# EAGLE design replacement (EAGLE 9.6.2)
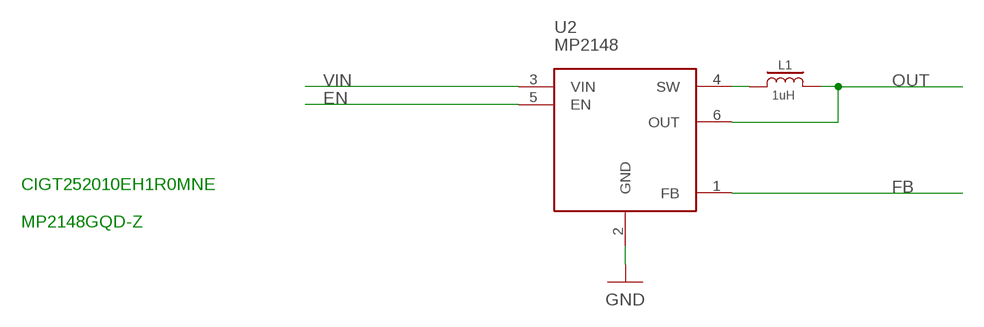
[diagram p0: schematic, sheet 1]

## Parts
L1  1uH  CIGT252010EH1R0MNE  [1008]
U2  MP2148  MP2148GQD-Z  [QFN6]

## Nets
EN: U2.5(EN)
FB: U2.1(FB)
GND: U2.2(GND)
N$1: L1.1 U2.4(SW)
OUT: L1.2 U2.6(OUT)
VIN: U2.3(VIN)

## Notes on the sheet
- CIGT252010EH1R0MNE
  
  MP2148GQD-Z

## Library data of the parts
L1 = INDUCTORS:CIGT252010EH1R0MNE: 1 µH Unshielded Thin Film Inductor 4.1 A 30mOhm Max 1008 (2520 Metric) -; DIGIKEY: 1276-6929-1-ND; HEIGHT: 1; PRICE_PER: 0.19
U2 = ICs:MP2148GQD-Z: Buck Switching Regulator IC Positive Adjustable 0.6V 1 Output 1A 6-VFDFN; DIGIKEY: 1589-1564-1-ND; HEIGHT: 1; PRICE_PER: 1.33

## Board
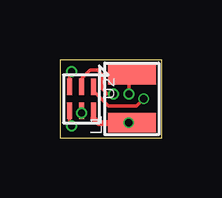
[diagram p1: board, top side]
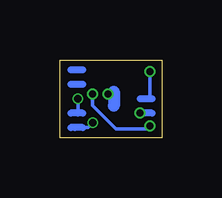
[diagram p2: board, bottom side, seen from below]

Size 4.25 x 3.25 mm. Coordinates in mm from the lower left corner, seen from the top.
Outline: 0,0 4.25,0 4.25,3.25 0,3.25 0,0
Copper layers (1*2*3*16): Top 0.035mm / dielectric 0.15mm / Route2 0.035mm / dielectric 1.11mm / Route3 0.035mm / dielectric 0.2mm / Bottom 0.035mm
Design rules "myDRC 4 layers 0.15mm": minimum track width 0.15mm, minimum drill 0.25mm, track to track 0.15mm, track to pad 0.15mm, pad to pad 0.15mm, via to via 0.15mm, smd to smd 0mil, copper to edge 0.25mm, drill to drill 0.25mm, minimum pad ring 10mil, minimum via ring 3mil, stop-mask expansion 4mil, vias tented up to drill 1mm, thermal gap 10mil

### Footprints (pad centres in the part's own frame; a part is rotated, then mirrored left to right if it is on the bottom)
1008 = smd 0.8 x 2: 1 1,0; 2 -1,0
QFN6 = smd 0.7 x 0.2: 1 -0.5,0.5; 2 -0.5,0; 3 -0.5,-0.5; 4 0.5,-0.5; 5 0.5,0; 6 0.5,0.5

### Placement (x,y rotation side)
L1  3,1.62 90 top
U2  0.9,1.62 270 top

### Tracks (layer width: path | path; a pad name or v marks a point on that pad's centre or on a via)
EN  (via drill 0.3)
  Top 0.15: U2.5 v0.9,1.02
  Bottom 0.3: 0.4,1.02 v0.9,1.02
FB  (via drill 0.3)
  Top 0.15: U2.1 1.4,1.95 2.02,1.32 3.2,1.32 v3.5,1.62
  Bottom 0.15: v3.5,1.62 3.5,1.02
  Bottom 0.3: 3.3,1.02 3.5,1.02 3.8,1.02
GND  (via drill 0.3)
  Top 0.15: v2.25,1.83 2,1.83 1.77,2.05 1.77,2.63 1.58,2.82 1.25,2.82 0.9,2.47 U2.2
  Bottom 0.15: v2.25,1.83 2.15,1.93 2,1.93
  Bottom 0.5: 2,1.93 2,1.32
N$1  (via drill 0.3)
  Top 0.15: L1.1 2.89,2.51 v2.89,1.82 | v0.49,0.49 0.49,0.53 0.4,0.62 U2.4
  Bottom 0.15: v2.89,1.82 2.89,1.34 1.91,0.36 0.61,0.36 v0.49,0.49
N$11
  Bottom 0.3: 3.3,2.83 3.8,2.83
N$12
  Bottom 0.3: 3.3,2.23 3.8,2.23
OUT  (via drill 0.3)
  Top 0.15: U2.6 1.4,0.82 | L1.2 v2.88,0.62
  Top 0.25: 1.4,0.82 1.6,0.62 v2.88,0.62
  Bottom 0.15: v2.88,0.62 3.08,0.43 3.62,0.43
  Bottom 0.3: 3.3,0.43 3.62,0.43 3.8,0.43
VIN  (via drill 0.3)
  Top 0.15: v0.49,2.75 0.4,2.67 U2.3
  Bottom 0.15: 0.9,1.62 0.5,1.62 v0.5,2.75 v0.49,2.75
  Bottom 0.3: 0.4,1.62 0.9,1.62